# EAGLE design neodk_v1.2 (EAGLE 9.6.2)
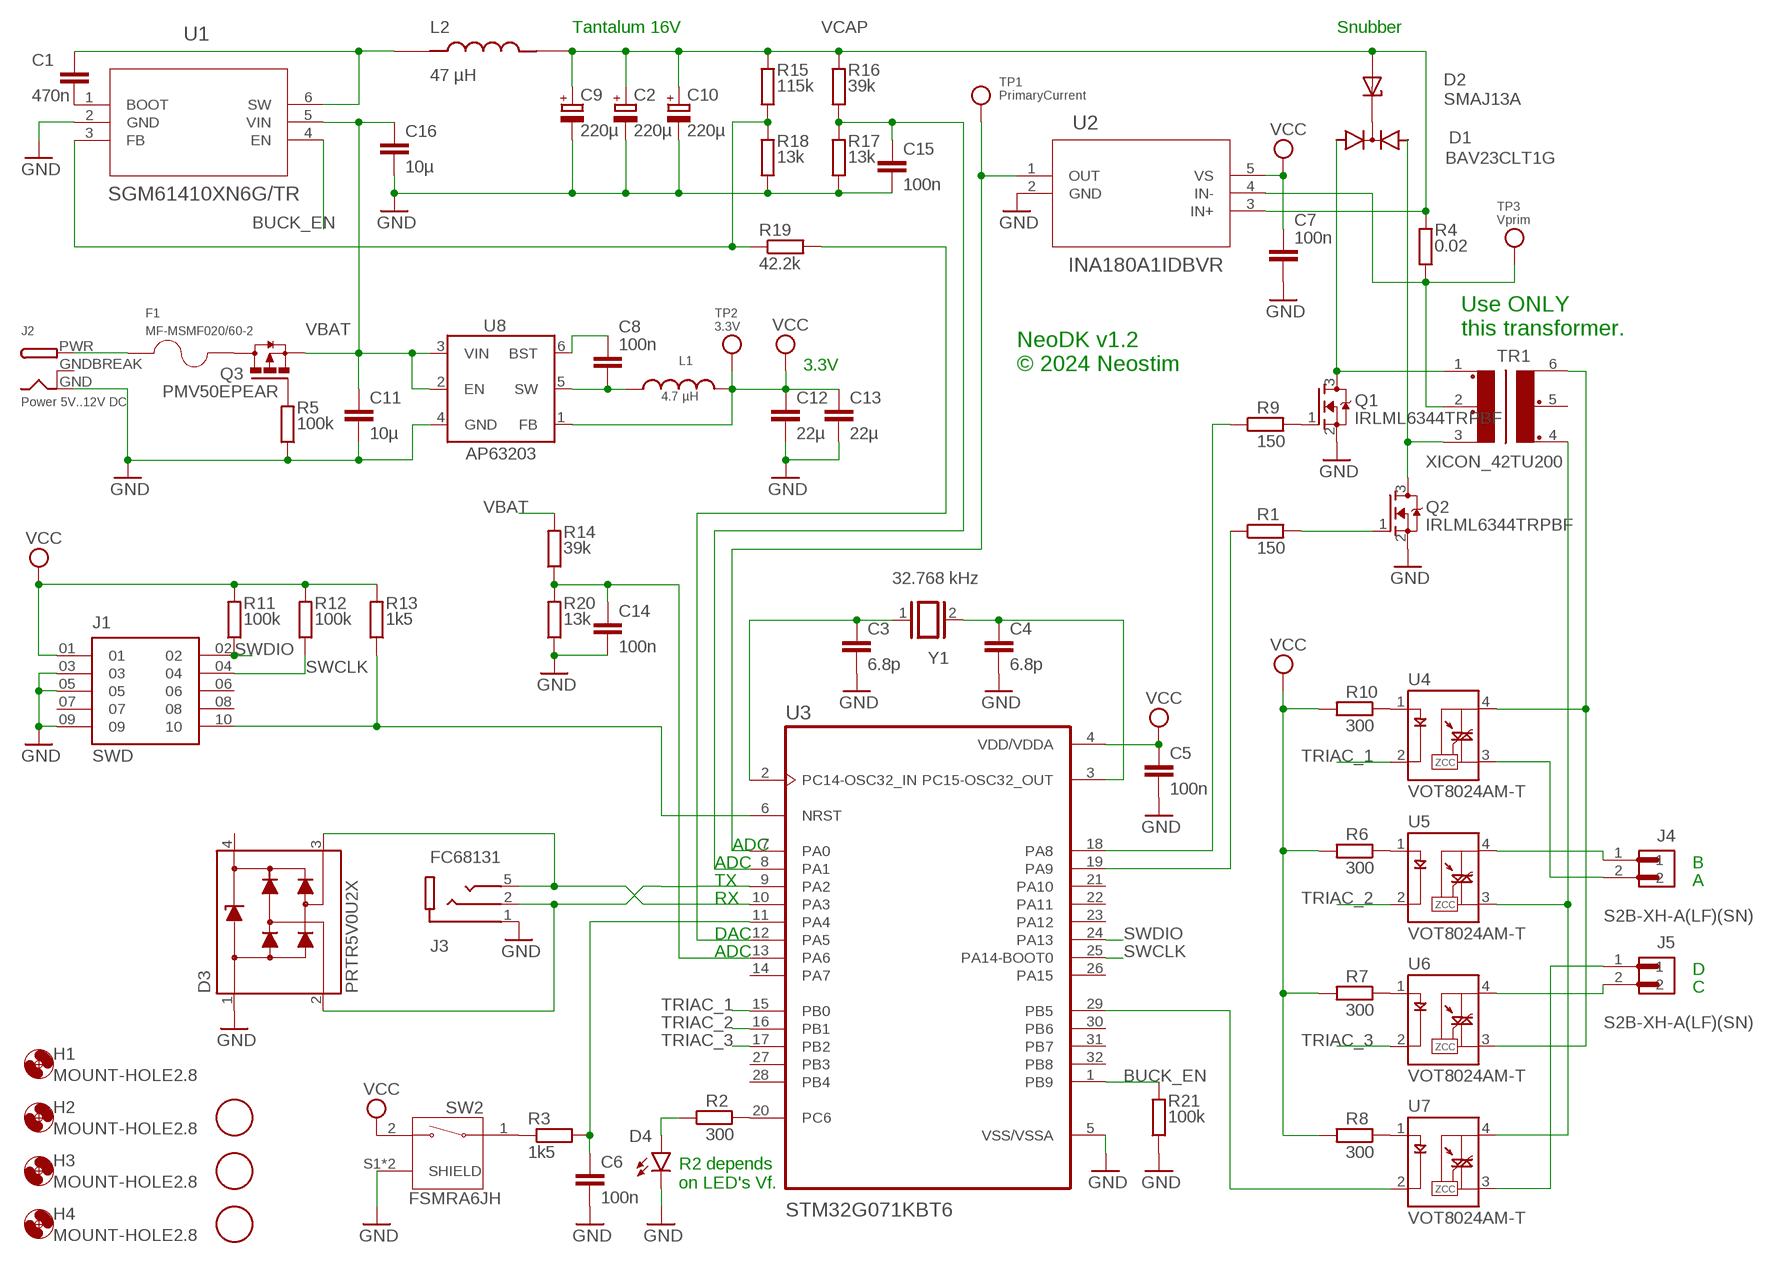
[diagram p0: schematic, sheet 1]

## Parts
C1  470n  C-EUC0603  [C0603]
C2  220µ  CPOL-EUSMCD  [SMC_D]
C3  6.8p  C-EUC0603  [C0603]
C4  6.8p  C-EUC0603  [C0603]
C5  100n  C-EUC0603  [C0603]
C6  100n  C-EUC0603  [C0603]
C7  100n  C-EUC0603  [C0603]
C8  100n  C-EUC0603  [C0603]
C9  220µ  CPOL-EUSMCD  [SMC_D]
C10  220µ  CPOL-EUSMCD  [SMC_D]
C11  10µ  C-EUC0603  [C0603]
C12  22µ  C-EUC0603  [C0603]
C13  22µ  C-EUC0603  [C0603]
C14  100n  C-EUC0603  [C0603]
C15  100n  C-EUC0603  [C0603]
C16  10µ  C-EUC0603  [C0603]
D1  BAV23CLT1G  DIODE-2AC|CASOT23  [SOT23]
D2  SMAJ13A  [DIOM4325X250N]
D3  PRTR5V0U2X  [SOT190P230X110-4N]
D4  LEDCHIP-LED0805  [CHIP-LED0805]
F1  MF-MSMF020/60-2  [FUSER_MF-MSMF020/60-2]
FID1  FIDUCIAL  [FIDUCIAL_1MM]
FID2  FIDUCIAL  [FIDUCIAL_1MM]
FID3  FIDUCIAL  [FIDUCIAL_1MM]
H1  MOUNT-HOLE2.8  [2,8]
H2  MOUNT-HOLE2.8  [2,8]
H3  MOUNT-HOLE2.8  [2,8]
H4  MOUNT-HOLE2.8  [2,8]
J1  SWD  FTSH-105-XX-X-DV  [SAMTEC_FTSH-105-XX-X-DV]
J2  Power 5V..12V DC  DCBARRELPTH  [DCJACK_2MM_PTH]
J3  FC68131  [CLIFF_FC68131]
J4  S2B-XH-A(LF)(SN)  [JST_S2B-XH-A(LF)(SN)]
J5  S2B-XH-A(LF)(SN)  [JST_S2B-XH-A(LF)(SN)]
L1  4.7 µH  VLS5045EX-4R7M  [IND_VLS5045EX-4R7M]
L2  47 µH  CLF7045NIT-470M-D  [IND_CLF7045NIT-470M-D]
Q1  IRLML6344TRPBF  MOSFET-NREFLOW  [SOT23]
Q2  IRLML6344TRPBF  MOSFET-NREFLOW  [SOT23]
Q3  PMV50EPEAR  [SOT23]
R1  150  R-EU_R0603  [R0603]
R2  300  R-EU_R0603  [R0603]
R3  1k5  R-EU_R0603  [R0603]
R4  0.02  R-EU_R1206  [R1206]
R5  100k  R-EU_R0603  [R0603]
R6  300  R-EU_R0603  [R0603]
R7  300  R-EU_R0603  [R0603]
R8  300  R-EU_R0603  [R0603]
R9  150  R-EU_R0603  [R0603]
R10  300  R-EU_R0603  [R0603]
R11  100k  R-EU_R0603  [R0603]
R12  100k  R-EU_R0603  [R0603]
R13  1k5  R-EU_R0603  [R0603]
R14  39k  R-EU_R0603  [R0603]
R15  115k  R-EU_R0603  [R0603]
R16  39k  R-EU_R0603  [R0603]
R17  13k  R-EU_R0603  [R0603]
R18  13k  R-EU_R0603  [R0603]
R19  42.2k  R-EU_R0603  [R0603]
R20  13k  R-EU_R0603  [R0603]
R21  100k  R-EU_R0603  [R0603]
SW2  FSMRA6JH  [TE_FSMRA6JH]
TP1  PrimaryCurrent  TESTPOINTROUND1MM  [TESTPOINT_ROUND_1MM]
TP2  3.3V  TESTPOINTROUND1MM  [TESTPOINT_ROUND_1MM]
TP3  Vprim  TESTPOINTROUND1MM  [TESTPOINT_ROUND_1MM]
TR1  XICON_42TU200  [42TUXXX]
U1  SGM61410XN6G/TR  [SOT-23-6_SNC]
U2  INA180A1IDBVR  [DBV5]
U3  STM32G071KBT6  [QFP80P900X900X160-32N]
U4  VOT8024AM-T  [SOP254P675X240-4N]
U5  VOT8024AM-T  [SOP254P675X240-4N]
U6  VOT8024AM-T  [SOP254P675X240-4N]
U7  VOT8024AM-T  [SOP254P675X240-4N]
U8  AP63203  [SOT23-6]
Y1  32.768 kHz  NX3215SA-32.768K-STD-MUA-8  [XTAL_NX3215SA-32.768K-STD-MUA-8]

## Nets
BTN_OUT1: C6.1 R3.2 U3.11(PA4)
BUCK_EN: R21.2 U1.4(EN) U3.1(PB9)
CSA_OUT: TP1.P$1 U2.1(OUT) U3.7(PA0)
GND: C2.- C3.2 C4.2 C5.2 C6.2 C7.2 C9.- C10.- C11.2 C12.2 C13.2 C14.2 C15.2 C16.2 D3.1(GND) D4.C J1.03 J1.05 J1.09 J2.GND J3.1(SLEEVE) Q1.2(S) Q2.2(S) R5.1 R17.1 R18.1 R20.1 R21.1 SW2.S1(SHIELD) SW2.S2(SHIELD) U1.2(GND) U2.2(GND) U3.5(VSS/VSSA) U8.4(GND)
N$1: D1.3(C) D2.C
N$2: R3.1 SW2.1
N$3: D1.1(A1) Q1.3(D) TR1.1
N$4: D1.2(A2) Q2.3(D) TR1.3
N$5: Q1.1(G) R9.2
N$6: Q2.1(G) R1.2
N$7: R2.2 U3.20(PC6)
N$8: D4.A R2.1
N$9: R4.1 TP3.P$1 TR1.2 U2.4(IN-)
N$10: R10.1 U4.1(A)
N$11: R6.1 U5.1(A)
N$12: R7.1 U6.1(A)
N$13: J4.1 U5.4(MT2)
N$14: R8.1 U7.1(A)
N$15: R1.1 U3.19(PA9)
N$16: U3.29(PB5) U7.2(C)
N$17: J5.2 U6.4(MT2)
N$18: TR1.4 U5.3(MT1) U7.4(MT2)
N$19: R9.1 U3.18(PA8)
N$20: TR1.6 U4.4(MT2) U6.3(MT1)
N$21: J4.2 U4.3(MT1)
N$22: J5.1 U7.3(MT1)
N$23: C4.1 U3.3(PC15-OSC32_OUT) Y1.2
N$24: C3.1 U3.2(PC14-OSC32_IN) Y1.1
N$25: C8.2 L1.1 U8.5(SW)
N$26: D3.3(I/O_2) J3.5(TIP) U3.10(PA3)
N$28: F1.1 J2.PWR
N$29: D3.2(I/O_1) J3.2(RING) U3.9(PA2)
N$30: F1.2 Q3.2(D)
N$31: Q3.1(G) R5.2
N$32: C1.1 L2.1 U1.6(SW)
N$33: C1.2 U1.1(BOOT)
N$34: C14.1 R14.1 R20.2 U3.13(PA6)
N$36: C8.1 U8.6(BST)
N$37: R15.1 R18.2 R19.1 U1.3(FB)
N$38: R19.2 U3.12(PA5)
N$39: J1.10 R13.1 U3.6(NRST)
SWCLK: J1.04 R12.1 U3.25(PA14-BOOT0)
SWDIO: J1.02 R11.1 U3.24(PA13)
TRIAC_1: U3.15(PB0) U4.2(C)
TRIAC_2: U3.16(PB1) U5.2(C)
TRIAC_3: U3.17(PB2) U6.2(C)
VBAT: C11.1 C16.1 Q3.3(S) R14.2 U1.5(VIN) U8.2(EN) U8.3(VIN)
VC_DIV4: C15.1 R16.1 R17.2 U3.8(PA1)
VCAP: C2.+ C9.+ C10.+ D2.A L2.2 R4.2 R15.2 R16.2 U2.3(IN+)
VCC [power]: C5.1 C7.1 C12.1 C13.1 J1.01 L1.2 R6.2 R7.2 R8.2 R10.2 R11.2 R12.2 R13.2 SW2.2 TP2.P$1 U2.5(VS) U3.4(VDD/VDDA) U8.1(FB)
Unconnected: D3.4(VCC) J1.06 J1.07 J1.08 TR1.5 U3.14(PA7) U3.21(PA10) U3.22(PA11) U3.23(PA12) U3.26(PA15) U3.27(PB3) U3.28(PB4) U3.30(PB6) U3.31(PB7) U3.32(PB8)

## Notes on the sheet
- Tantalum 16V | Snubber
- Use ONLY
  this transformer.
- 3.3V
- NeoDK v1.2
  © 2024 Neostim
- ADC
- ADC | B
- TX | A
- RX
- DAC
- ADC
- D
- C
- R2 depends
  on LED's Vf.

## Power pins joined to a net without a drawn wire
GNDBREAK: J2.GNDBREAK

## Library data of the parts
C1 C5-C8 C11-C16 = rcl:C-EU: CAPACITOR, European symbol; SPICEPREFIX: C
C2 C9 C10 = rcl:CPOL-EU: POLARIZED CAPACITOR, European symbol; MP: TPSE227M016R0150; OC_FARNELL: 2852794; SPICEPREFIX: C
C3 C4 = rcl:C-EU: CAPACITOR, European symbol; OC_FARNELL: 721943; SPICEPREFIX: C
D1 = diode:DIODE-2AC|CA: Dual DIODE Anode-Cathode|Cathode-Anode; OC_FARNELL: 2630280
D2 = SMAJ13A:SMAJ13A: Check availability <https://pricing.snapeda.com/parts/SMAJ13A-TR/STMicroelectronics/view-part?ref=eda>; DESCRIPTION: "TRANSIL 400W 13V UNIDIR SMA, Vrwm:13V, Breakdown Voltage Range:15.2V, Vc Max:27.2V, Ippm:85A, Pd:3.3W, Breakdown Voltage:14.4V, Diode Type:Unidirectional, Operating Temperature Range:-55°C to +150°C, Package / Case:DO-214AC, Peak Pulse Power:400W, Power Dissipation Pd:3.3W"; MF: STMicroelectronics; MP: SMAJ13A-TR; PACKAGE: DO-214AC
D3 = PRTR5V0U2X:PRTR5V0U2X: DIODE, TVS, DUAL, SOT-143B; Diode Type: TVS, Bidirectional; Voltage, Stand-off: 5.5V; Voltage, Vbr: 9V; Termination T... Check availability <https://pricing.snapeda.com/parts/PRTR5V0U2X/Nexperia%20USA/view-part?ref=eda>; DESCRIPTION: Clamp - Ipp Tvs Diode SOT-143B; MF: Nexperia USA; MP: PRTR5V0U2X; PACKAGE: TO-253-4 Nexperia USA Inc.
D4 = led:LED: LED OSRAM: - CHIPLED LG R971, LG N971, LY N971, LG Q971, LY Q971, LO R971, LY R971 LH N974, LH R974 LS Q976, LO Q976, LY Q976 LO Q996 - Hyper CHIPLED LW Q18S LB Q993, LB Q99A, LB R99A - SideLED LS A670, LO A670, LY A670, LG A670, LP A670 LB A673, LV A673, LT A673, LW A673 LH A674 LY A675 LS A676, LA A676, LO A676, LY A676, LW A676 LS A679, LY A679, LG A679 - Hyper Micro SIDELED® LS Y876, LA Y876, LO Y876, LY Y876 LT Y87S - SmartLED LW L88C, LW L88S LB L89C, LB L89S, LG L890 LS L89K, LO L89K, LY L89K LS L896, LA L896, LO L896, LY L896 - TOPLED LS T670, LO T670, LY T670, LG T670, LP T670 LSG T670, LSP T670, LSY T670, LOP T670, LYG T670 LG T671, LOG T671, LSG T671 LB T673, LV T673, LT T673, LW T673 LH T674 LS T676, LA T676, LO T676, LY T676, LB T676, LH T676, LSB T676, LW T676 LB T67C, LV T67C, LT T67C, LS T67K, LO T67K, LY T67K, LW E67C LS E67B, LA E67B, LO E67B, LY E67B, LB E67C, LV E67C, LT E67C LW T67C LS T679, LY T679, LG T679 LS T770, LO T770, LY T770, LG T770, LP T770 LB T773, LV T773, LT T773, LW T773 LH T774 LS E675, LA E675, LY E675, LS T675 LS T776, LA T776, LO T776, LY T776, LB T776 LHGB T686 LT T68C, LB T68C - Hyper Mini TOPLED® LB M676 - Mini TOPLED Santana® LG M470 LS M47K, LO M47K, LY M47K Source: http://www.osram.convergy.de LUXEON: - LUMILED® LXK2-PW12-R00, LXK2-PW12-S00, LXK2-PW14-U00, LXK2-PW14-V00 LXK2-PM12-R00, LXK2-PM12-S00, LXK2-PM14-U00 LXK2-PE12-Q00, LXK2-PE12-R00, LXK2-PE12-S00, LXK2-PE14-T00, LXK2-PE14-U00 LXK2-PB12-K00, LXK2-PB12-L00, LXK2-PB12-M00, LXK2-PB14-N00, LXK2-PB14-P00, LXK2-PB14-Q00 LXK2-PR12-L00, LXK2-PR12-M00, LXK2-PR14-Q00, LXK2-PR14-R00 LXK2-PD12-Q00, LXK2-PD12-R00, LXK2-PD12-S00 LXK2-PH12-R00, LXK2-PH12-S00 LXK2-PL12-P00, LXK2-PL12-Q00, LXK2-PL12-R00 Source: www.luxeon.com KINGBRIGHT: KA-3528ASYC Source: www.kingbright.com
F1 = MF-MSMF020_60-2:MF-MSMF020/60-2: Check availability <https://pricing.snapeda.com/parts/MF-MSMF020/60-2/Bourns/view-part?ref=eda>; DESCRIPTION: Fuse PTC resettable SMD 1812 0.2A; MF: Bourns; MP: MF-MSMF020/60-2; PACKAGE: 1812
FID1-FID3 = adafruit:FIDUCIAL: For use by pick and place machines to calibrate the vision/machine, 1mm By microbuilder.eu
H1-H4 = holes:MOUNT-HOLE: MOUNTING HOLE with drill center marker
J1 = FTSH-105-XX-X-DV:FTSH-105-XX-X-DV: Connector Header Surface Mount 10 position 0.050" (1.27mm) Check availability <https://pricing.snapeda.com/parts/FTSH-105-01-L-DV/Samtec/view-part?ref=eda>; DESCRIPTION: Connector Header Surface Mount 10 position 0.050 (1.27mm); MF: Samtec; MP: FTSH-105-01-L-DV
J2 = adafruit:DCBARREL: 2.0mm DC Barrel Jack DCJACK_2MM_PTH - Through Hole Jack (4UConnector: 05537)
J3 = FC68131:FC68131: Stereo Jack, 3.5mm, 3pos, Pcb Check availability <https://pricing.snapeda.com/parts/FC68131/Cliff/view-part?ref=eda>; DESCRIPTION: 3.50mm (0.141, 1/8, Mini Plug) - Headphone Phone Jack Stereo (3 Conductor, TRS) Connector Solder; MF: Cliff; MP: FC68131
J4 J5 = S2B-XH-A_LF__SN_:S2B-XH-A(LF)(SN): XH Series 2.5mm 2 Position Through Hole Shrouded Header Connector Check availability <https://pricing.snapeda.com/parts/S2B-XH-A%28LF%29%28SN%29/JST%20Sales/view-part?ref=eda>; DESCRIPTION: Connector Header Through Hole, Right Angle 2 position 0.098 (2.50mm); MF: JST Sales; MP: S2B-XH-A(LF)(SN)
L1 = VLS5045EX-4R7M:VLS5045EX-4R7M: FIXED IND 4.7UH 3.2A 46.8 MOHM Check availability <https://pricing.snapeda.com/parts/VLS5045EX-4R7M/TDK/view-part?ref=eda>; AVAILABILITY: In Stock; CHECK_PRICES: https://www.snapeda.com/parts/VLS5045EX-4R7M/TDK/view-part/?ref=eda; DESCRIPTION: 4.7 µH Shielded Drum Core, Wirewound Inductor 3.2 A 46.8mOhm Max Nonstandard; MF: TDK; MP: VLS5045EX-4R7M; PACKAGE: NON STANDARD-2 TDK; PRICE: None; SNAPEDA_LINK: https://www.snapeda.com/parts/VLS5045EX-4R7M/TDK/view-part/?ref=snap
L2 = CLF7045NIT-470M-D:CLF7045NIT-470M-D: Check availability <https://pricing.snapeda.com/parts/CLF7045NIT-470M-D/TDK/view-part?ref=eda>; DESCRIPTION: 47 µH Shielded Drum Core, Wirewound Inductor 1.26 A 160mOhm Max Nonstandard; MF: TDK; MP: CLF7045NIT-470M-D
Q1 Q2 = adafruit:MOSFET-N: N-Channel Mosfet 2N7002E - 60V 260mA SOT23 [Digikey: 2N7002ET1GOSTR-ND] - REEL BSH103 - 30V 850mA SOT23 [Digikey: 568-5013-1-ND]; OC_FARNELL: 1857299
Q3 = PMV50EPEAR:PMV50EPEAR; MP: PMV50EPEAR; OC_FARNELL: 2900300
R1-R3 R5-R21 = rcl:R-EU_: RESISTOR, European symbol; SPICEPREFIX: R
R4 = rcl:R-EU_: RESISTOR, European symbol; OC_FARNELL: 3953982; SPICEPREFIX: R
SW2 = FSMRA6JH:FSMRA6JH: Switch, Tactile, Spno, r/a; DESCRIPTION: Switch, Tactile, Spno, r/a; MF: TE Connectivity; MP: FSMRA6JH; OC_FARNELL: 1555989
TP1-TP3 = microbuilder:TESTPOINT: Test Point Various test points for characterisation and PCB testing TESTPOINT_SMT - Compact Surface Mount Test Point [Digikey: 5016KTR-ND]
TR1 = Xicon_42TU:XICON_42TU200
U1 = SGM61410XN6G:SGM61410XN6G/TR; MP: SGM61410XN6G/TR
U2 = INA180A1IDBV:INA180A1IDBVR; MP: INA180A1IDBVR; OC_FARNELL: 3118130
U3 = STM32G071KBT6:STM32G071KBT6: None Check availability <https://pricing.snapeda.com/parts/STM32G070KBT6/STMicroelectronics/view-part?ref=eda>; AVAILABILITY: In Stock; DESCRIPTION: ARM® Cortex®-M0+ STM32G0 Microcontroller IC 32-Bit Single-Core 64MHz 128KB (128K x 8) FLASH 32-LQFP (7x7); MF: STMicroelectronics; MP: STM32G070KBT6; OC_FARNELL: 3009964; PACKAGE: LQFP-32 STMicroelectronics; PRICE: None; PURCHASE-URL: https://pricing.snapeda.com/search/part/STM32G070KBT6/?ref=eda
U4-U7 = VOT8024AM-T:VOT8024AM-T: OPTOCOUPLER PHOTOTRIAC SOP-4 Check availability <https://pricing.snapeda.com/parts/VOT8024AM-T/Vishay%20Semiconductor%20Opto%20Division/view-part?ref=eda>; DESCRIPTION: Optoisolator Triac Output 3750Vrms 1 Channel 4-SOP; MF: Vishay Semiconductor Opto Division; MP: VOT8024AM-T
U8 = AP63203:AP63203: Diodes Inc. AP63203 3.8V-32V input 3.3V Buck The AP63200/AP63201/AP63203/AP63205 is a 2A, synchronous buck converter with a wide input voltage range of 3.8V to 32V and fully integrates a 125mΩ high-side power MOSFET and a 68mΩ lowside power MOSFET to provide high-efficiency step-down DC/DC conversion Check availability <https://pricing.snapeda.com/parts/AP63203/Diodes%20Zetex/view-part?ref=eda>; DESCRIPTION: Conv DC-DC 3.8V to 32V Synchronous Step Down Single-Out 3.3V 2A 6-Pin TSOT-26 T/R; MF: Diodes Zetex; MP: AP63203; PACKAGE: TSOT-26
Y1 = NX3215SA-32.768K-STD-MUA-8:NX3215SA-32.768K-STD-MUA-8: Check availability <https://pricing.snapeda.com/parts/NX3215SA-32.768K-STD-MUA-8/NDK%20America%2C/view-part?ref=eda>; AVAILABILITY: In Stock; DESCRIPTION: 32.768 kHz ±20ppm Crystal 12.5pF 70 kOhms 2-SMD, No Lead; MF: NDK America,; MP: NX3215SA-32.768K-STD-MUA-8; PACKAGE: SMD-2 NDK; PRICE: None

## Net classes
1 power: width 0.254 mm

## Board
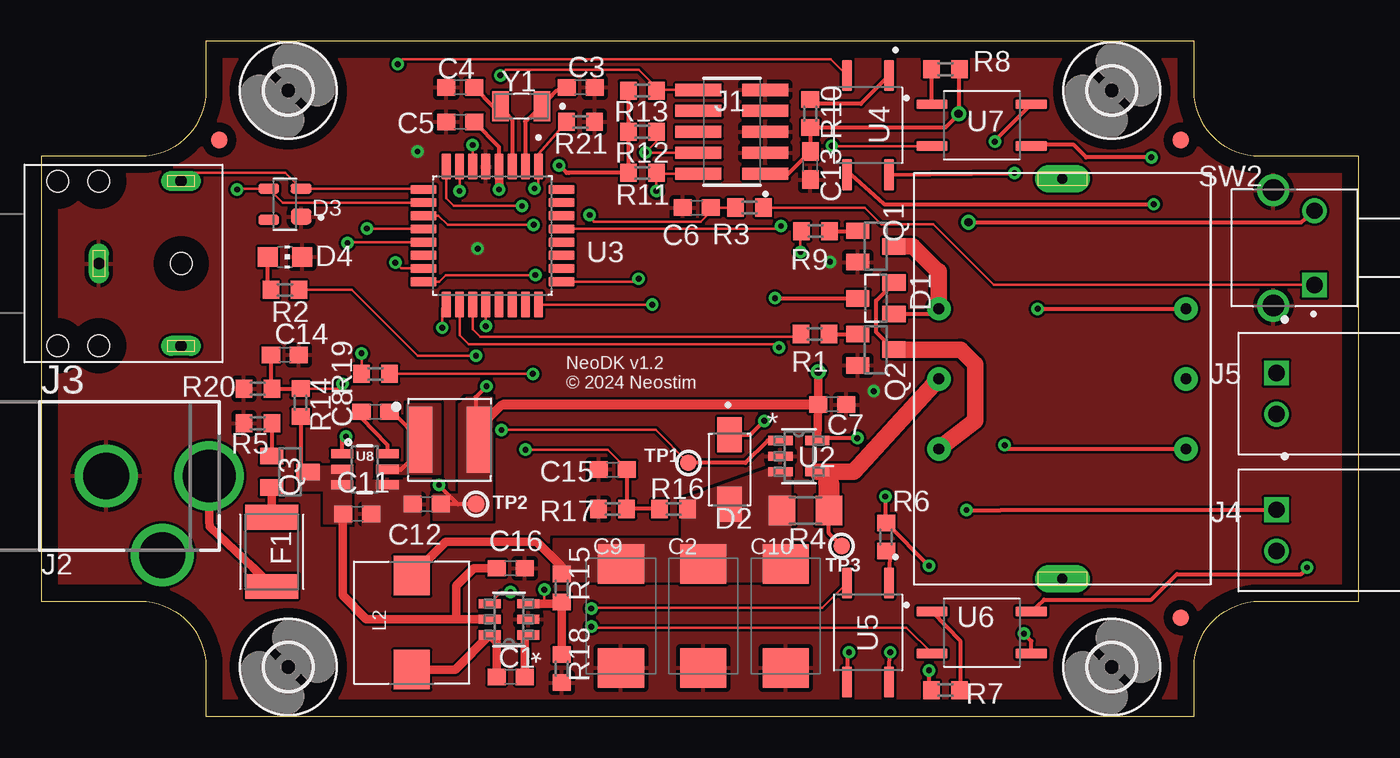
[diagram p1: board, top side]
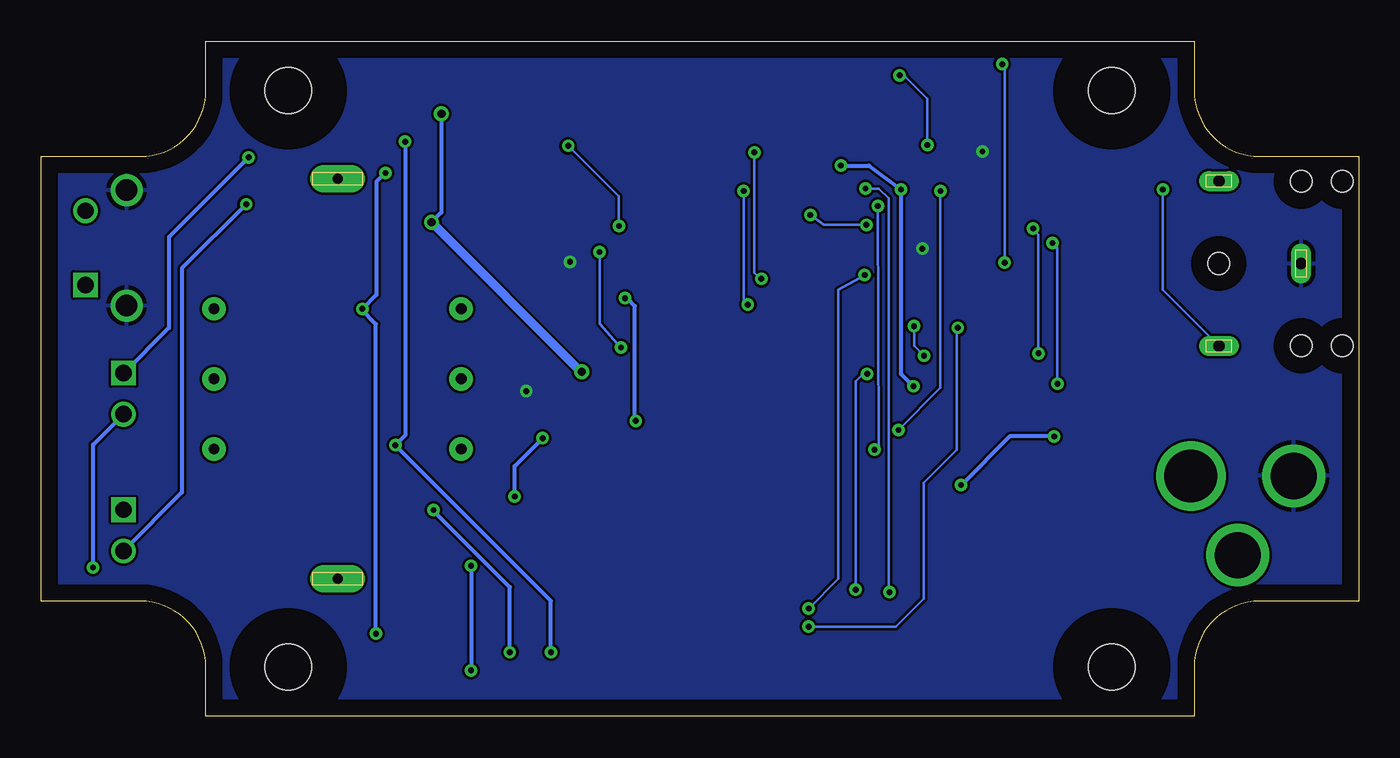
[diagram p2: board, bottom side, seen from below]

Size 80 x 41 mm. Coordinates in mm from the lower left corner, seen from the top.
Outline: 0,7 6,7 arc-90 10,3 10,0 70,0 70,3 arc-90 74,7 80,7 80,34 74,34 arc-90 70,38 70,41 10,41 10,38 arc-90 6,34 0,34 0,7
Copper layers (1*16): Top 0.035mm / dielectric 1.5mm / Bottom 0.035mm
Design rules "default": minimum track width 6mil, minimum drill 0.35mm, track to track 6mil, track to pad 6mil, pad to pad 6mil, via to via 6mil, smd to smd 6mil, copper to edge 40mil, drill to drill 6mil, minimum pad ring 10mil, minimum via ring 8mil, stop-mask expansion 4mil, vias tented up to drill 0mil, thermal gap 10mil

### Footprints (pad centres in the part's own frame; a part is rotated, then mirrored left to right if it is on the bottom)
C0603 = smd 1.1 x 1: 1 -0.85,0; 2 0.85,0
SMC_D = smd 2.4 x 2.8: + -3.15,0; - 3.15,0
SOT23 = smd 1 x 1.4: 1 -0.95,-1.1; 2 0.95,-1.1; 3 0,1.1
DIOM4325X250N = smd 2.12 x 1.5: A 2.115,0; C -2.115,0
SOT190P230X110-4N = smd 1.26 x 0.99: 1 -0.98,0.75 | smd 1.26 x 0.59: 2 -0.98,-0.95; 3 0.98,-0.95; 4 0.98,0.95
CHIP-LED0805 = smd 1.2 x 1.2: A 0,-1.05; C 0,1.05
FUSER_MF-MSMF020/60-2 = smd 1.5 x 3.2: 1 -2.1,0; 2 2.1,0
FIDUCIAL_1MM = smd 1 x 1: 1 0,0
2,8 = hole 2.8: 0,0
SAMTEC_FTSH-105-XX-X-DV = smd 0.74 x 2.79: 01 -2.54,-2.035; 02 -2.54,2.035; 03 -1.27,-2.035; 04 -1.27,2.035; 05 0,-2.035; 06 0,2.035; 07 1.27,-2.035; 08 1.27,2.035; 09 2.54,-2.035; 10 2.54,2.035
DCJACK_2MM_PTH = drill 2.8: GND 0,7.35; GNDBREAK 4.8,10.75 | drill 3.2: PWR 0,13.6
CLIFF_FC68131 = drill 0.7 long: 1 0,0; 2 5,5; 5 5,-5 | hole 1.3: 5,0; 0,-5; 0,5; -2.5,5; -2.5,-5
JST_S2B-XH-A(LF)(SN) = drill 1 square: 1 -1.25,0 | drill 1: 2 1.25,0
IND_VLS5045EX-4R7M = smd 1.5 x 4: 1 -1.8,0; 2 1.8,0
IND_CLF7045NIT-470M-D = smd 2.4 x 2.2: 1 -2.85,0; 2 2.85,0
R0603 = smd 1 x 1.1: 1 -0.85,0; 2 0.85,0
R1206 = smd 1.6 x 1.803: 1 -1.422,0; 2 1.422,0
TE_FSMRA6JH = drill 0.99 square: 1 0,0 | drill 0.99: 2 4.5,0 | drill 1.3: S1 -1.255,2.49; S2 5.755,2.49
TESTPOINT_ROUND_1MM = smd 1 x 1: P$1 0,0
42TUXXX = drill 0.65 pad 1.422: 1 4.255,7.5; 2 0,7.5; 3 -4.255,7.5; 4 -4.255,-7.5; 5 0,-7.5; 6 4.255,-7.5 | drill 0.6 pad 1.676 long: 7 -12.146,0; 8 12.146,0
SOT-23-6_SNC = smd 1.321 x 0.559: 1 -1.168,0.95; 2 -1.168,0; 3 -1.168,-0.95; 4 1.168,-0.95; 5 1.168,0; 6 1.168,0.95
DBV5 = smd 1.473 x 0.559: 1 -1.118,0.95; 2 -1.118,0; 3 -1.118,-0.95; 4 1.118,-0.95; 5 1.118,0.95
QFP80P900X900X160-32N = smd 1.56 x 0.55: 1 -4.18,2.8; 2 -4.18,2; 3 -4.18,1.2; 4 -4.18,0.4; 5 -4.18,-0.4; 6 -4.18,-1.2; 7 -4.18,-2; 8 -4.18,-2.8; 17 4.18,-2.8; 18 4.18,-2; 19 4.18,-1.2; 20 4.18,-0.4; 21 4.18,0.4; 22 4.18,1.2; 23 4.18,2; 24 4.18,2.8 | smd 0.55 x 1.56: 9 -2.8,-4.18; 10 -2,-4.18; 11 -1.2,-4.18; 12 -0.4,-4.18; 13 0.4,-4.18; 14 1.2,-4.18; 15 2,-4.18; 16 2.8,-4.18; 25 2.8,4.18; 26 2,4.18; 27 1.2,4.18; 28 0.4,4.18; 29 -0.4,4.18; 30 -1.2,4.18; 31 -2,4.18; 32 -2.8,4.18
SOP254P675X240-4N = smd 1.89 x 0.59: 1 -3.01,1.27; 2 -3.01,-1.27; 3 3.01,-1.27; 4 3.01,1.27
SOT23-6 = smd 0.55 x 1.35: 1 -0.95,-1.375; 2 0,-1.375; 3 0.95,-1.375; 4 0.95,1.375; 5 0,1.375; 6 -0.95,1.375
XTAL_NX3215SA-32.768K-STD-MUA-8 = smd 1 x 1.8: 1 -1.25,0; 2 1.25,0

### Placement (x,y rotation side)
C1  28.5,2.4 0 top
C2  40.2,6.1 270 top
C3  32.75,38.2 0 top
C4  25.45,38.2 180 top
C5  25.45,36.1 180 top
C6  39.8,30.9 180 top
C7  48.03,18.94 0 top
C8  20.3,18.5 0 top
C9  35.2,6.1 270 top
C10  45.2,6.1 270 top
C11  19.2,12.3 0 top
C12  23.4,12.9 180 top
C13  46.7,33.45 270 top
C14  14.8,21.95 0 top
C15  34.7,15 180 top
C16  28.5,9 0 top
D1  50.68,25.39 90 top
D2  41.8,15 270 top
D3  14.8,31.1 180 top
D4  14.8,27.9 270 top
F1  14,10 90 top
FID1  10.8,35 0 top
FID2  69.2,35 0 top
FID3  69.2,6 0 top
H1  15,3 0 top
H2  65,3 0 top
H3  65,38 0 top
H4  15,38 0 top
J1  41.94,35.5 90 top
J2  -3.4,14.6 270 top
J3  3.5,27.5 0 top
J4  75,11.3 270 top
J5  75,19.6 270 top
L1  24.8,16.8 0 top
L2  22.5,5.7 90 top
Q1  50.67,28.54 270 top
Q2  50.67,22.27 270 top
Q3  15.1,14.85 270 top
R1  46.97,23.22 0 top
R2  14.8,25.9 0 top
R3  43,30.9 180 top
R4  46.4,12.5 180 top
R5  13.15,17.8 0 top
R6  51.3,10.9 90 top
R7  54.9,1.6 180 top
R8  54.9,39.3 0 top
R9  47.02,29.47 0 top
R10  46.7,36.6 270 top
R11  36.5,33 180 top
R12  36.5,35.5 180 top
R13  36.5,38 180 top
R14  15.75,19.05 270 top
R15  31.6,7.8 90 top
R16  38.4,12.6 0 top
R17  34.7,12.6 0 top
R18  31.6,2.9 90 top
R19  20.3,20.8 180 top
R20  13.15,19.9 0 top
R21  32.75,36.1 180 top
SW2  77.3,26.2 90 top
TP1  39.3,15.4 0 top
TP2  26.4,12.9 0 top
TP3  48.6,10.35 0 top
TR1  62,20.5 90 top
U1  28.4,5.9 180 top
U2  46,15.8 0 top
U3  27.4,29.2 270 top
U4  50.2,35.9 270 top
U5  50.2,5.1 270 top
U6  57.1,5.1 0 top
U7  57.1,35.9 0 top
U8  19.65,15.01 270 top
Y1  29.15,37.05 180 top

### Tracks (layer width: path | path; a pad name or v marks a point on that pad's centre or on a via)
BTN_OUT1  (via drill 0.35)
  Top 0.152: R3.2 C6.1 40.65,30.65 40.05,30.05 33.55,30.05 33.36,30.39 v33.3,30.45 | U3.11 24.12,30.4 24.67,29.85 v29.9,29.85
  Bottom 0.152: v29.9,29.85 32.5,29.85 v33.3,30.45
BUCK_EN  (via drill 0.35)
  Top 0.152: R21.2 30.19,34.14 U3.1 30.19,32.29 v29.95,32.05 | U1.4 27.93,7.55 v28.5,7.55
  Bottom 0.152: v28.5,7.55 28.55,7.6 28.55,24.95 28.55,31.45 29.15,32.05 v29.95,32.05
CSA_OUT  (via drill 0.35)
  Top 0.152: U3.7 v25.4,31.9 | v27.94,17.4 37.3,17.4 TP1.P$1
  Top 0.254: TP1.P$1 39.4,15.4 42.75,15.4 44.1,16.75 U2.1
  Bottom 0.152: v27.94,17.4 25.4,19.94 v25.4,31.9
GND  (via drill 0.35)
  other vias: 26.5,28.4 22.85,34.3 47.9,27.6 50.55,19.75
  pour Top (rank 4): 0,41 0,0 80,0 80,41
  pour Top (no thermals): 19.5,11.55 23.05,11.55 23.05,14.3 19.5,14.3
  pour Bottom: 0,41 0,0 80,0 80,41
N$1  (via drill 0.35)
  Top 0.254: v44.55,25.4 D1.3 | D2.C 43.06,17.11 v43.9,17.95
  Bottom 0.254: v43.9,17.95 43.95,18 43.95,24.92 44.38,25.35 v44.55,25.4
N$2
  Top 0.152: SW2.1 57.85,26.2 54.15,29.9 51,29.9 50,30.9 R3.1
N$3
  Top 0.254: D1.1 54.69,24.44 TR1.1
  Top 1.016: TR1.1 54.5,27.03 54.4,27.05 52.91,28.54 Q1.3
N$4
  Top 0.254: Q2.3 50.7,23.34 50.7,25.25 D1.2
  Top 1.016: Q2.3 55.83,22.27 56.7,21.4 56.7,17.95 TR1.3
N$5
  Top 0.254: R9.2 49.57,29.47 Q1.1
N$6
  Top 0.254: R1.2 Q2.1
N$7  (via drill 0.35)
  Top 0.152: U3.20 v27,23.7 | v27,23.7 27,23.75 v27,23.7 | v26.4,21.9 22.85,21.9 18.85,25.9 R2.2
  Bottom 0.152: v27,23.7 27,22.5 v26.4,21.9
N$8
  Top 0.254: R2.1 13.75,26.1 D4.A
N$9
  Top 0.254: U2.4 47.81,14.19 | TP3.P$1 47.82,11.13 R4.1
  Top 1.016: U2.4 49.35,14.85 TR1.2
  Top 1.27: 47.81,14.19 R4.1
N$10
  Top 0.254: U4.1 49.76,37.2 47.15,37.2 R10.1
N$11
  Top 0.254: R6.1 51.52,9.78 U5.1
N$12
  Top 0.254: U6.1 55.8,4.61 55.8,1.6 R7.1
N$13  (via drill 0.35)
  Top 0.254: J4.1 58.3,12.55 58.27,12.53 v56.17,12.53 | U5.4 51.52,3.82 51.55,3.85 v51.55,3.9
  Bottom 0.254: v51.55,3.9 51.55,7.85 56.2,12.5 v56.17,12.53
N$14
  Top 0.254: U7.1 54.05,37.21 54.05,37.23 R8.1
N$15
  Top 0.152: U3.19 26.2,23.5 26.65,23.05 45.95,23.05 R1.1
N$16  (via drill 0.35)
  Top 0.152: U7.2 48.02,34.63 v48,34.65 | U3.29 44.8,29.6 44.95,29.75 v44.92,29.77
  Bottom 0.152: v44.92,29.77 44.92,31.57 v48,34.65
N$17  (via drill 0.35)
  Top 0.254: U6.4 60.89,7.1 67.4,7.1 68.95,8.65 76.5,8.65 76.85,9 v76.85,9.05
  Bottom 0.254: v76.85,9.05 76.85,16.5 J5.2
N$18  (via drill 0.35)
  Top 0.254: U7.4 57.9,34.96 v57.9,34.9 | U5.3 48.98,3.83 v49.05,3.9 | v58.5,16.47 58.72,16.25 TR1.4
  Bottom 0.254: v57.9,34.9 57.9,17.07 v58.5,16.47 49.05,7.02 v49.05,3.9
N$19  (via drill 0.35)
  Top 0.152: U3.18 25.4,23.15 25.95,22.6 44.5,22.6 44.65,22.55 v44.8,22.4 | v46.1,28.2 46.1,29.4 R9.1
  Bottom 0.152: v44.8,22.4 46.1,23.84 v46.1,28.2
N$20  (via drill 0.35)
  Top 0.254: U6.3 60.11,4.56 60.12,4.58 v59.67,5.03 | U4.4 v59.09,32.99 v59.1,33 | v60.5,24.75 69,24.75 TR1.6
  Bottom 0.254: v59.67,5.03 59.67,23.82 60.55,24.7 | 60.55,24.7 v60.5,24.75 | v59.1,33 59.65,32.45 59.65,25.6 60.55,24.7
N$21  (via drill 0.35)
  Top 0.254: U4.3 49.19,32.89 51.18,31.1 v67.55,31.1
  Bottom 0.254: v67.55,31.1 71.45,27.2 71.45,13.6 J4.2
N$22  (via drill 0.35)
  Top 0.254: U7.3 60.18,34.7 62.7,34.7 63.45,33.95 v67.4,33.95
  Bottom 0.254: v67.4,33.95 72.25,29.1 72.25,23.6 J5.1
N$23
  Top 0.254: U3.3 28.59,36.21 Y1.2 27.46,37.01 C4.1
N$24
  Top 0.254: U3.2 29.39,36.11 Y1.1 31.25,37.97 C3.1
N$25
  Top 0.254: C8.2 21.3,18.5 L1.1 23,16.7 | U8.5 21.74,15.01 21.8,14.95 23,16.15
  pour Top (no thermals): 20.35,14.75 24.25,14.75 24.25,18.95 22.2,18.95 22.2,15.25 20.35,15.25
N$26  (via drill 0.35)
  Top 0.152: v11.9,32 11.95,32.05 D3.3 14.67,31.2 U3.10
  Bottom 0.152: v11.9,32 11.9,25.9 J3.5
N$28
  Top 0.508: J2.PWR 10.2,11.88 10.22,11.53 12.85,9.05 F1.1
N$29
  Top 0.152: U3.9 23.17,32.05 D3.2 14.83,33 9,33 J3.2
N$30
  Top 0.508: Q3.2 F1.2
N$31
  Top 0.254: R5.2 Q3.1
N$32
  Top 0.508: C1.1 27.65,4.53 U1.6 25.13,2.85 L2.1
N$33
  Top 0.508: C1.2 29.35,4.73 U1.1
N$34  (via drill 0.35)
  Top 0.152: U3.13 18.7,28.8 18.65,28.75 v18.6,28.75 | v18.3,20.2 18,19.9 R14.1
  Top 0.254: R14.1 R20.2 13.95,19.95 C14.1
  Bottom 0.152: v18.6,28.75 18.3,28.45 v18.3,20.2
N$36
  Top 0.254: C8.1 19.45,18.1 21.02,16.49 U8.6
N$37  (via drill 0.35)
  Top 0.152: R19.1 v29.85,20.8 | v30.55,7.7 30.55,6.85
  Top 0.508: R18.2 R15.1 31.5,6.85 30.55,6.85 U1.3
  Bottom 0.152: v30.55,7.7 30.55,20.35 30.1,20.8 v29.85,20.8
N$38  (via drill 0.35)
  Top 0.152: v19.77,29.62 23.2,29.62 U3.12 | R19.2 v19.45,22.05
  Bottom 0.152: v19.45,22.05 19.45,29.25 19.8,29.6 v19.77,29.62
N$39  (via drill 0.35)
  Top 0.152: R13.1 37.51,38.04 | 37.51,38.04 J1.10 | 37.51,38.04 36.29,39.26 28.21,39.26 v27.88,38.92 | U3.6 v26.2,34.7
  Bottom 0.152: v26.2,34.7 26.2,37.5 27.55,38.85 27.62,38.92 v27.88,38.92
SWCLK  (via drill 0.35)
  Top 0.152: J1.04 36.72,34.23 v36.7,34.25 37.35,34.9 R12.1 | v36.27,26.57 36.1,26.4 U3.25
  Bottom 0.152: v36.7,34.25 36.7,26.95 36.3,26.55 v36.27,26.57
SWDIO  (via drill 0.35)
  Top 0.152: J1.02 37.39,32.96 R11.1 v37.35,31.9 | v37.1,25 30.22,25 U3.24
  Bottom 0.152: v37.35,31.9 37.35,25.25 v37.1,25
TRIAC_1  (via drill 0.35)
  Top 0.152: U4.2 47.93,39.91 21.95,39.91 v21.65,39.61 | v21.5,27.55 21.85,27.2 U3.15
  Bottom 0.152: v21.5,27.55 21.5,39.46 v21.65,39.61
TRIAC_2  (via drill 0.35)
  Top 0.152: U5.2 47.42,6.6 33.5,6.6 v33.4,6.55 | v30,26.8 24.57,26.8 24.17,26.4 U3.16
  Bottom 0.152: v33.4,6.55 31.6,8.35 31.6,25.9 v30,26.8
TRIAC_3  (via drill 0.35)
  Top 0.152: U6.2 52.52,5.4 33.45,5.4 v33.4,5.45 | U3.17 24.35,24.77 v24.35,23.6
  Bottom 0.152: v33.4,5.45 28.1,5.45 26.4,7.15 26.4,14.2 24.4,16.2 24.4,23.55 v24.35,23.6
VBAT
  Top 0.254: R14.2 15.75,15.3 Q3.3
  Top 0.508: 25.2,5.9 U1.5 | C16.1 26.25,9 25.2,7.95 25.2,5.9 | 25.2,5.9 19.75,5.9 18.3,7.35 18.3,12.25 C11.1
  pour Top (no thermals): 15.6,15.2 18.8,15.2 18.8,11.7 17.2,11.7 17.2,13.7 15.6,13.7
VC_DIV4  (via drill 0.35)
  Top 0.152: U3.8 24.6,31.45 25.05,31 29.15,31 v29.2,31 | v29.4,16.2 34.4,16.2 35.55,15.05 C15.1
  Top 0.254: R16.1 R17.2 C15.1
  Bottom 0.152: v29.2,31 29.16,16.44 v29.4,16.2
VCAP
  Top 0.254: 39.04,9.31 39.1,9.25
  Top 0.508: L2.2 24.55,10.6 30.1,10.6 31.6,9.1 R15.2
  pour Top (no thermals): 31.1,8.2 45.5,8.2 45.5,15 44.11,15 38.9,13.17 38.9,10.75 31.1,10.75
VCC  (via drill 0.35, 0.5)
  Top 0.254: C5.1 27.79,34.59 U3.4 | U8.1 18.27,16.77 v18.5,17 | R13.2 R12.2 R11.2 32.05,33 31.9,33 v31.45,33.45 | v49.55,16.9 47.27,16.9 U2.5 | J1.01 45.36,32.96 C13.1 R10.2 54.9,35.75 55.75,36.6 55.75,36.65 | 55.75,36.65 v55.7,36.6 55.75,36.65 | v56.3,30 76.5,30 SW2.2 | v27.04,20.05 26.38,19.38 26.38,17.35 | 26.38,17.35 L1.2 26.38,17.35 | TP2.P$1 25.35,12.9 | 25.35,12.9 C12.1 | v24.15,14.05 25.3,12.9 25.35,12.9 | 55.75,36.65 R8.2 | v53.9,9.15 R6.2 51.25,11.8 v51.25,13.35 | v53.9,2.8 53.9,1.75 R7.2
  Top 0.508: U2.5 C7.1 47.18,20.78 47.25,20.85 v47.17,20.93 | v27.8,32 U3.4 | 28.11,18.94 27.96,18.94 26.38,17.35
  Top 0.61: C7.1 28.11,18.94
  Bottom 0.254: v18.5,17 21.2,17 v24.15,14.05 | v51.25,13.35 51.25,15.2 v49.55,16.9 | v55.7,36.6 55.7,30.6 v56.3,30 | v27.04,20.05 27.8,20.81 v27.8,32 29.73,33.45 v31.45,33.45 | v53.9,9.15 v53.9,2.8
  Bottom 0.508: v56.3,30 47.23,20.93 v47.17,20.93
  pour Top (rank 2, no thermals): 25.35,18.95 25.35,13.45 23.8,13.45 23.8,11.95 27.4,11.95 27.4,19.35 25.8,19.35 25.4,18.95

### Text on the board
tPlace: NeoDK v1.2 / © 2024 Neostim